# EAGLE design BR103_MKL_3357_Lichtplatine_J1_006_02_04 (EAGLE 5.10)
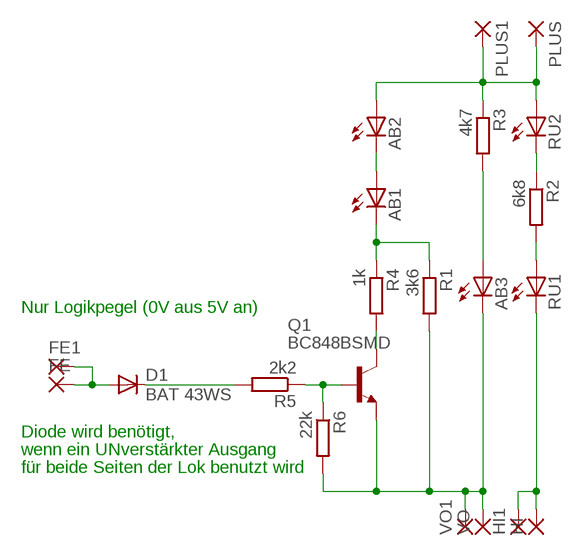
[diagram p0: schematic, sheet 1]

## Parts
AB1  LEDCHIP-LED0603  [CHIP-LED0603]
AB2  LEDCHIP-LED0603  [CHIP-LED0603]
AB3  LEDCHIP-LED0603  [CHIP-LED0603]
D1  BAT 43WS  DIODE-SOD323-R2  [SOD323-R2]
FE  SMD2  [SMD1,27-2,54]
FE1  SMD2  [SMD1,27-2,54]
HI  SMD2  [SMD1,27-2,54]
HI1  SMD2  [SMD1,27-2,54]
PLUS  SMD2  [SMD1,27-2,54]
PLUS1  SMD2  [SMD1,27-2,54]
Q1  BC848BSMD  [SOT23]
R1  3k6  R-EU_R0603  [R0603]
R2  6k8  R-EU_R0603  [R0603]
R3  4k7  R-EU_R0603  [R0603]
R4  1k  R-EU_R0603  [R0603]
R5  2k2  R-EU_R0603  [R0603]
R6  22k  R-EU_R0603  [R0603]
RU1  LEDCHIP-LED0603  [CHIP-LED0603]
RU2  LEDCHIP-LED0603  [CHIP-LED0603]
VO  SMD2  [SMD1,27-2,54]
VO1  SMD2  [SMD1,27-2,54]

## Nets
N$1: AB3.A R3.2
N$2: AB1.A AB2.C
N$3: AB1.C R1.1 R4.1
N$4: Q1.3(C) R4.2
N$5: D1.A FE1.1(P) FE.1(P)
N$6: R2.2 RU1.A
N$7: R2.1 RU2.C
N$8: Q1.1(B) R5.1 R6.1
N$10: AB2.A PLUS1.1(P) PLUS.1(P) R3.1 RU2.A
N$11: AB3.C Q1.2(E) R1.2 R6.2 VO1.1(P) VO.1(P)
N$12: D1.C R5.2
N$13: HI1.1(P) HI.1(P) RU1.C

## Notes on the sheet
- Nur Logikpegel (0V aus 5V an)
- Diode wird benötigt,
- wenn ein UNverstärkter Ausgang
- für beide Seiten der Lok benutzt wird

## Library data of the parts
AB1-AB3 RU1 RU2 = led:LED: LED OSRAM: - CHIPLED LG R971, LG N971, LY N971, LG Q971, LY Q971, LO R971, LY R971 LH N974, LH R974 LS Q976, LO Q976, LY Q976 LO Q996 - Hyper CHIPLED LW Q18S LB Q993, LB Q99A, LB R99A - SideLED LS A670, LO A670, LY A670, LG A670, LP A670 LB A673, LV A673, LT A673, LW A673 LH A674 LY A675 LS A676, LA A676, LO A676, LY A676, LW A676 LS A679, LY A679, LG A679 - Hyper Micro SIDELED® LS Y876, LA Y876, LO Y876, LY Y876 LT Y87S - SmartLED LW L88C, LW L88S LB L89C, LB L89S, LG L890 LS L89K, LO L89K, LY L89K LS L896, LA L896, LO L896, LY L896 - TOPLED LS T670, LO T670, LY T670, LG T670, LP T670 LSG T670, LSP T670, LSY T670, LOP T670, LYG T670 LG T671, LOG T671, LSG T671 LB T673, LV T673, LT T673, LW T673 LH T674 LS T676, LA T676, LO T676, LY T676, LB T676, LH T676, LSB T676, LW T676 LB T67C, LV T67C, LT T67C, LS T67K, LO T67K, LY T67K, LW E67C LS E67B, LA E67B, LO E67B, LY E67B, LB E67C, LV E67C, LT E67C LW T67C LS T679, LY T679, LG T679 LS T770, LO T770, LY T770, LG T770, LP T770 LB T773, LV T773, LT T773, LW T773 LH T774 LS E675, LA E675, LY E675, LS T675 LS T776, LA T776, LO T776, LY T776, LB T776 LHGB T686 LT T68C, LB T68C - Hyper Mini TOPLED® LB M676 - Mini TOPLED Santana® LG M470 LS M47K, LO M47K, LY M47K Source: http://www.osram.convergy.de LUXEON: - LUMILED® LXK2-PW12-R00, LXK2-PW12-S00, LXK2-PW14-U00, LXK2-PW14-V00 LXK2-PM12-R00, LXK2-PM12-S00, LXK2-PM14-U00 LXK2-PE12-Q00, LXK2-PE12-R00, LXK2-PE12-S00, LXK2-PE14-T00, LXK2-PE14-U00 LXK2-PB12-K00, LXK2-PB12-L00, LXK2-PB12-M00, LXK2-PB14-N00, LXK2-PB14-P00, LXK2-PB14-Q00 LXK2-PR12-L00, LXK2-PR12-M00, LXK2-PR14-Q00, LXK2-PR14-R00 LXK2-PD12-Q00, LXK2-PD12-R00, LXK2-PD12-S00 LXK2-PH12-R00, LXK2-PH12-S00 LXK2-PL12-P00, LXK2-PL12-Q00, LXK2-PL12-R00 Source: www.luxeon.com KINGBRIGHT: KA-3528ASYC Source: www.kingbright.com
D1 = diode:DIODE-: DIODE
FE FE1 HI HI1 PLUS PLUS1 VO VO1 = wirepad:SMD2: SMD PAD
Q1 = transistor-npn:BC848*: NPN Transistor
R1-R6 = rcl:R-EU_: RESISTOR, European symbol

## Board
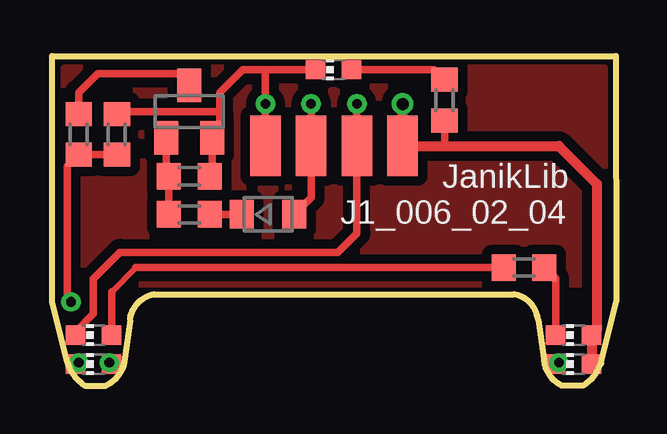
[diagram p1: board, top side]
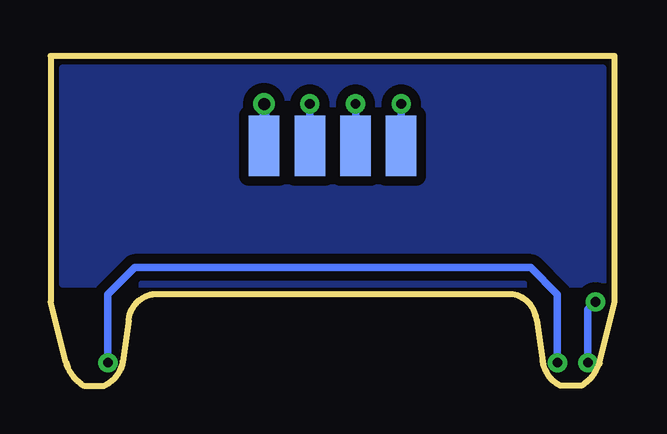
[diagram p2: board, bottom side, seen from below]

No outline drawn. Coordinates in mm, seen from the top.
Copper layers (1*16): Top 0.035mm / dielectric 1.5mm / Bottom 0.035mm
Design rules "default *": minimum track width 7mil, minimum drill 0.6mm, track to track 8mil, track to pad 8mil, pad to pad 8mil, via to via 8mil, smd to smd 8mil, copper to edge 40mil, drill to drill 8mil, minimum pad ring 10mil, minimum via ring 8mil, stop-mask expansion 4mil, vias tented up to drill 0mil, thermal gap 10mil
bKeepout: area 4.1,4 to 19.2,13.8
Milling: 16 lines

### Footprints (pad centres in the part's own frame; a part is rotated, then mirrored left to right if it is on the bottom)
CHIP-LED0603 = smd 0.8 x 0.8: A 0,-0.75; C 0,0.75
SOD323-R2 = smd 1 x 1.2: A 1.1,0; C -1.1,0
SMD1,27-2,54 = smd 1.27 x 2.54: 1 0,0
SOT23 = smd 1 x 1.4: 1 -0.95,-1.1; 2 0.95,-1.1; 3 0,1.1
R0603 = smd 1 x 1.1: 1 -0.85,0; 2 0.85,0

### Placement (x,y rotation side)
AB1  1.73,0.9 90 top
AB2  21.73,0.9 90 top
AB3  11.73,13.19 90 top
D1  9,7.14 0 top
FE  10.79,10 0 top
FE1  10.79,10 0 bottom
HI  12.7,10 0 bottom
HI1  12.7,10 0 top
PLUS  14.61,10 0 bottom
PLUS1  14.61,10 180 top
Q1  5.71,11.43 0 top
R1  2.7,10.48 90 top
R2  19.67,4.92 180 top
R3  16.35,11.91 90 top
R4  1.11,10.48 90 top
R5  5.71,7.14 0 top
R6  5.71,8.73 0 top
RU1  1.73,2.1 90 top
RU2  21.73,2.1 90 top
VO  8.89,10 0 bottom
VO1  8.89,10 0 top

### Tracks (layer width: path | path; a pad name or v marks a point on that pad's centre or on a via)
N$1
  Top 0.305: AB3.A 15.92,13.19 R3.2
N$2  (via drill 0.4)
  Top 0.305: AB1.A v2.38,0.95 | AB2.C 21.07,1 v21.11,0.95
  Bottom 0.305: v21.11,0.95 21.11,3.81 20,4.92 3.49,4.92 2.38,3.81 v2.38,0.95
N$3  (via drill 0.4)
  Top 0.254: AB1.C 0.95,0.95 | v0.79,3.49 0.64,3.65
  Top 0.305: R1.1 R4.1 0.64,9.15 0.64,3.65 | 0.95,0.95 v1.11,0.95
  Bottom 0.305: v1.11,0.95 1.11,3.17 v0.79,3.49
N$4
  Top 0.305: R4.2 1.11,12.22 1.91,13.02 5.23,13.02 Q1.3
N$5  (via drill 0.4)
  Top 0.305: v10.79,11.75 FE1.1 10.79,7.84 D1.A
  Bottom 0.305: v10.79,11.75 FE1.1
N$6
  Top 0.254: 2.48,3.9 3.49,4.92
  Top 0.305: 3.49,4.92 R2.2 | RU1.A 2.48,3.9
N$7
  Top 0.305: RU2.C 20.98,4.46 R2.1
N$8
  Top 0.305: Q1.1 4.76,8.83 R6.1 R5.1
N$9
  pour Bottom (isolate 0.406): 0.5,13.25 23,13.25 23,4.25 0.5,4.25
  pour Top (isolate 0.406): 0.5,13.25 23,13.25 23,4.25 0.5,4.25
N$10  (via drill 0.5)
  Top 0.305: 16.35,10 R3.1
  Top 0.406: v14.61,11.75 PLUS1.1 16.35,10 21.11,10 22.7,8.41 22.7,2.33 RU2.A AB2.A
  Bottom 0.406: v14.61,11.75 PLUS1.1
N$11  (via drill 0.4)
  Top 0.305: VO1.1 v8.89,11.75 8.89,13.18 | AB3.C 10.98,13.18 8.89,13.18 | R1.2 2.78,11.43 6.99,11.43 | 8.89,13.18 7.94,13.18 6.99,12.22 6.99,11.43 | 6.99,11.43 6.99,10.65 Q1.2 6.67,8.83 R6.2
  Bottom 0.305: v8.89,11.75 VO1.1
N$12
  Top 0.305: R5.2 D1.C
N$13  (via drill 0.4)
  Top 0.254: RU1.C 0.98,2.25
  Top 0.305: v12.7,11.75 HI1.1 12.7,6.35 11.91,5.56 2.82,5.56 1.71,4.45 1.71,2.98 0.98,2.25
  Bottom 0.305: v12.7,11.75 HI1.1

### Text on the board
tNames: JanikLib | J1_006_02_04
tStop: BR103 LED
bStop: BR103 LED | Für Märklin 3357 | vo | Fl | hi | + | design by Janik Merz